# Altium schematic sheet DPPXHK_POWER_SOURCE.SCHDOC
size A4
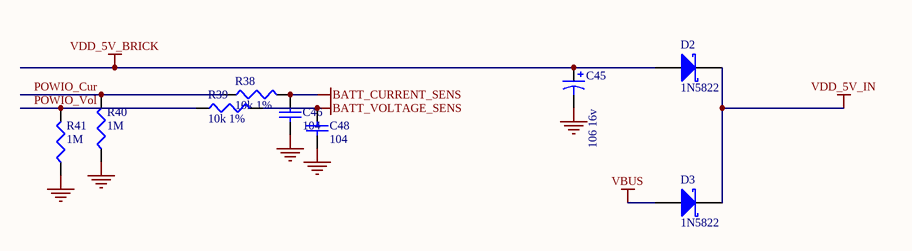
[diagram p0: DPPXHK_POWER_SOURCE.SCHDOC]

## Parts
C45  106 16v  [LC0402]
C46  104  [LC0402]
C48  104  [LC0402]
D2  1N5822  [SMA]
D3  1N5822  [SMA]
R38  10k 1%  [0402R]
R39  10k 1%  [0402R]
R40  1M  [0402R]
R41  1M  [0402R]

## Nets
BATT_CURRENT_SENS: C46.2 R38.2
BATT_VOLTAGE_SENS: C48.2 R39.2
GND: C45.2 C46.1 C48.1 R40.1 R41.1
VBUS: D3.1(A)
VDD_5V_BRICK: C45.1 D2.1(A)
VDD_5V_IN: D2.2(K) D3.2(K)
POWIO_Cur: R38.1 R40.2
POWIO_Vol: R39.1 R41.2

## Library data of the parts
C45 = Cap Pol3: Polarized Capacitor (Surface Mount); Published: 8-Jun-2000; LatestRevisionDate: 17-Jul-2002; LatestRevisionNote: Re-released for DXP Platform.; PackageReference: C0805; Publisher: Altium Limited
C46 C48 = Cap: Capacitor; Published: 8-Jun-2000; LatestRevisionDate: 17-Jul-2002; LatestRevisionNote: Re-released for DXP Platform.; Publisher: Altium Limited
D2 D3 = D Schottky: Schottky Diode; pin to pad: 1>2 2>1; Published: 8-Jun-2000; LatestRevisionDate: 17-Jul-2002; LatestRevisionNote: Re-released for DXP Platform.; PackageReference: SMB; Publisher: Altium Limited; Code_JEDEC: DO-214-AA
R38-R41 = Res3: Resistor; Published: 8-Jun-2000; LatestRevisionDate: 4-Mar-2005; LatestRevisionNote: PCB Footprint replaced.; Publisher: Altium Limited